# EAGLE design SD_prog (EAGLE 9.5.2)
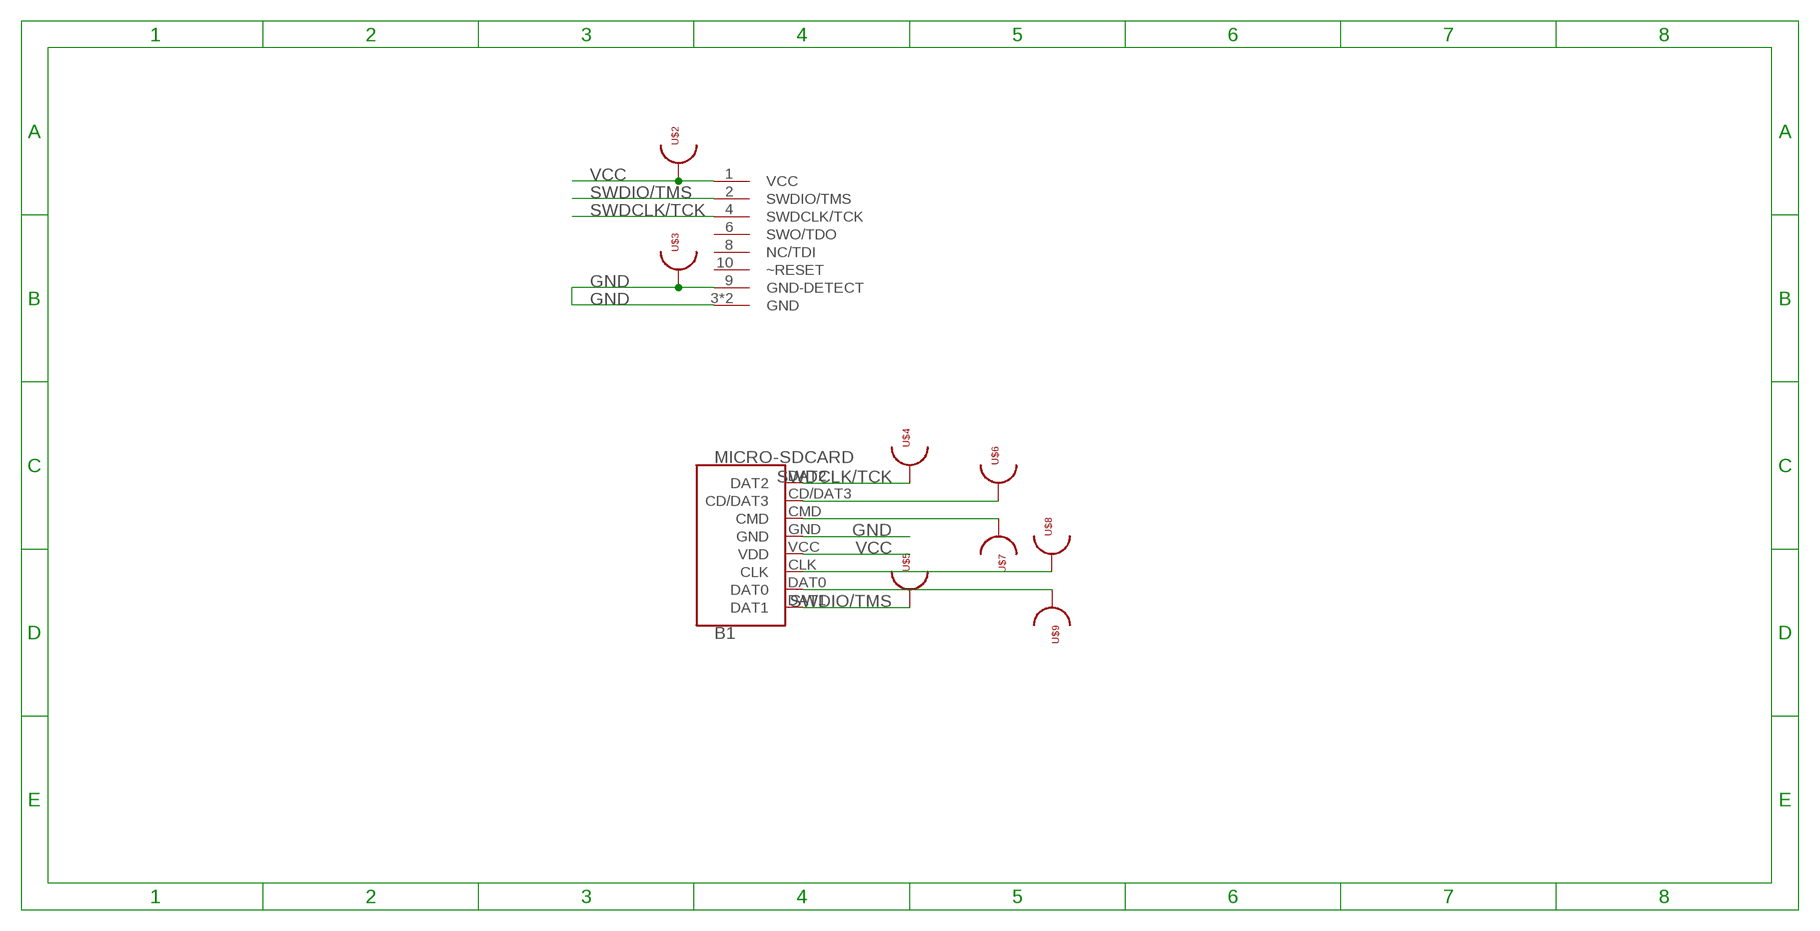
[diagram p0: schematic, sheet 1]

## Parts
B1  MICRO-SDCARD  [MICRO-SDCARD]
U$1  2X5_0.05"_CORTEX_DEBUGTH_NOKEY_UNSHROUDED  [2X5_0.05"_TH_NS]
U$2  TESTPOINT_33  [TESTPOINT_33]
U$3  TESTPOINT_33  [TESTPOINT_33]
U$4  TESTPOINT_33  [TESTPOINT_33]
U$5  TESTPOINT_33  [TESTPOINT_33]
U$6  TESTPOINT_22  [TESTPOINT_22]
U$7  TESTPOINT_22  [TESTPOINT_22]
U$8  TESTPOINT_22  [TESTPOINT_22]
U$9  TESTPOINT_22  [TESTPOINT_22]

## Nets
GND: B1.GND U$1.3(GND) U$1.5(GND) U$1.9(GND-DETECT) U$3.P$1
N$1: B1.CD/DAT3 U$6.P$1
N$2: B1.CMD U$7.P$1
N$3: B1.CLK U$8.P$1
N$4: B1.DAT0 U$9.P$1
SWDCLK/TCK: B1.DAT2 U$1.4(SWDCLK/TCK) U$4.P$1
SWDIO/TMS: B1.DAT1 U$1.2(SWDIO/TMS) U$5.P$1
VCC: B1.VCC(VDD) U$1.1(VCC) U$2.P$1
Unconnected: U$1.6(SWO/TDO) U$1.8(NC/TDI) U$1.10(~RESET)

## Library data of the parts
B1 = SD_Card:MICRO-SDCARD: microSD Card Footprint This is the mechnical footprint with connections for soldering a microSD card - NOT for a socket for the card. SparkFun Products: MicroSD Card with Adapter - 8 GB <https://www.sparkfun.com/products/11609> SparkFun microSD Sniffer <https://www.sparkfun.com/products/9419>
U$1 = con-cortex:2X5_0.05"_CORTEX_DEBUG
U$2-U$5 = test_points:TESTPOINT_33
U$6-U$9 = test_points:TESTPOINT_22

## Net classes
0 default: width 0.229 mm, drill 0.762 mm, clearance 0.254 mm

## Board
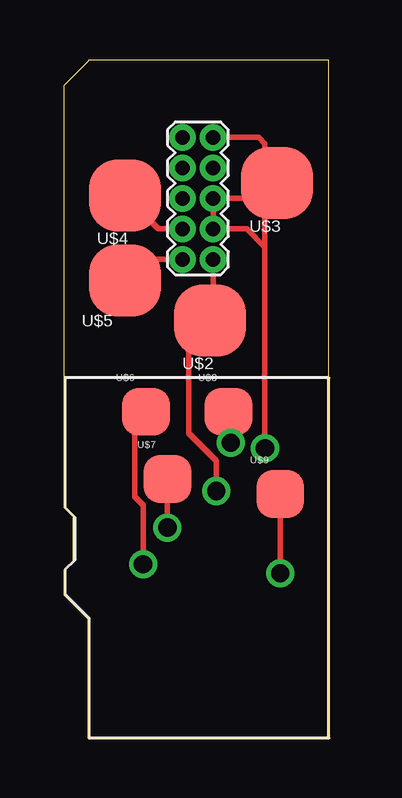
[diagram p1: board, top side]
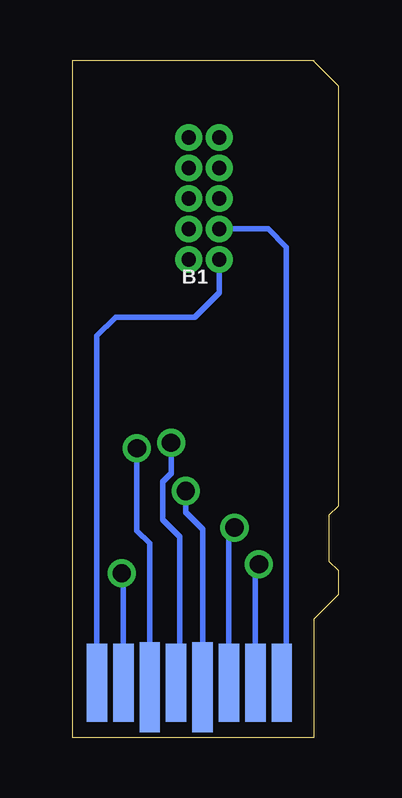
[diagram p2: board, bottom side, seen from below]

Size 11.05 x 28.25 mm. Coordinates in mm from the lower left corner, seen from the top.
Outline: 1.02,0 11.05,0 11.05,28.25 1.02,28.25 1.02,28.19 0,27.18 0,9.65 0.38,9.27 0.38,7.37 0,6.99 0,5.97 1.02,4.95 1.02,0
Copper layers (1*16): Top 0.035mm / dielectric 1.5mm / Bottom 0.035mm
Design rules "default": minimum track width 6mil, minimum drill 0.35mm, track to track 6mil, track to pad 6mil, pad to pad 6mil, via to via 6mil, smd to smd 6mil, copper to edge 40mil, drill to drill 6mil, minimum pad ring 10mil, minimum via ring 8mil, stop-mask expansion 4mil, vias tented up to drill 0mil, thermal gap 10mil

### Footprints (pad centres in the part's own frame; a part is rotated, then mirrored left to right if it is on the bottom)
MICRO-SDCARD = smd 0.85 x 3.25: CD/DAT3 2.52,-5.32; CLK -0.78,-5.32; CMD 1.42,-5.32; DAT0 -2.98,-5.32; DAT1 -4.08,-5.32; DAT2 3.62,-5.32 | smd 0.85 x 3.75: GND -1.88,-5.52; VCC 0.32,-5.52
2X5_0.05"_TH_NS = drill 0.6 pad 0.95: 1 -2.54,-0.635; 2 -2.54,0.635; 3 -1.27,-0.635; 4 -1.27,0.635; 5 0,-0.635; 6 0,0.635; 7 1.27,-0.635; 8 1.27,0.635; 9 2.54,-0.635; 10 2.54,0.635
TESTPOINT_33 = smd 3 x 3: P$1 0,0
TESTPOINT_22 = smd 2 x 2: P$1 0,0

### Placement (x,y rotation side)
B1  5.97,7.62 0 bottom
U$1  5.59,22.48 90 top
U$2  6.1,17.4 0 top
U$3  8.89,23.11 0 top
U$4  2.54,22.61 0 top
U$5  2.54,19.05 0 top
U$6  3.43,13.59 0 top
U$7  4.32,10.79 0 top
U$8  6.86,13.59 0 top
U$9  9.02,10.16 0 top

### Tracks (layer width: path | path; a pad name or v marks a point on that pad's centre or on a via)
GND  (via drill 0.76)
  Top 0.229: v8.38,12.06 8.38,20.45 | 8.38,20.45 7.62,21.21 U$1.3 U$1.5 7.62,22.48 8.25,23.11 U$3.P$1 | U$1.9 8.13,25.02 8.38,24.77 8.38,20.45
  Bottom 0.229: B1.GND 7.85,8.1 8.38,8.64 v8.38,12.06
N$1  (via drill 0.76)
  Top 0.229: v3.3,7.24 3.3,9.7 2.95,10.05 2.95,13.11 U$6.P$1
  Bottom 0.229: B1.CD/DAT3 3.45,7.09 v3.3,7.24
N$2  (via drill 0.76)
  Top 0.229: v4.32,8.76 U$7.P$1
  Bottom 0.229: B1.CMD 4.55,8.53 v4.32,8.76
N$3  (via drill 0.76)
  Top 0.229: U$8.P$1 6.96,13.49 v6.96,12.29
  Bottom 0.229: v6.96,12.29 6.96,11.02 7.3,10.68 7.3,9.08 6.6,8.38 6.6,2.44 B1.CLK
N$4  (via drill 0.76)
  Top 0.229: v9.02,6.86 U$9.P$1
  Bottom 0.229: B1.DAT0 8.95,6.79 v9.02,6.86
SWDCLK/TCK
  Top 0.229: U$1.4 3.94,21.21 U$4.P$1
  Bottom 0.229: U$1.4 2.92,21.21 2.16,20.45 2.16,2.49 B1.DAT2
SWDIO/TMS
  Top 0.229: U$1.2 3.43,19.94 U$5.P$1
  Bottom 0.229: B1.DAT1 10.05,16.75 9.27,17.53 5.97,17.53 4.95,18.54 U$1.2
VCC  (via drill 0.76)
  Top 0.229: 6.35,19.81 U$1.1 6.22,17.53 U$2.P$1 5.21,16.51 5.21,12.7 6.35,11.56 v6.35,10.29
  Bottom 0.229: B1.VCC 5.65,8.7 6.35,9.4 v6.35,10.29